# EasyEDA Pro project ProProject_Kame Quadrapot_2024-12-26.epro, schematic LU9685 + Buck + charging
Create Date: 2024-12-05; Page Name: LU9685 + Buck + charging; Project Name: Kame Quadrapot; Schematic Name: LU9685 + Buck + charging; Update Date: 2024-12-16; Company: EasyEDA.com; Drawn: EasyEDA; Page Size: A3; Part Number: JLCPCB-001; Reviewed: EasyEDA; Version: V0.1
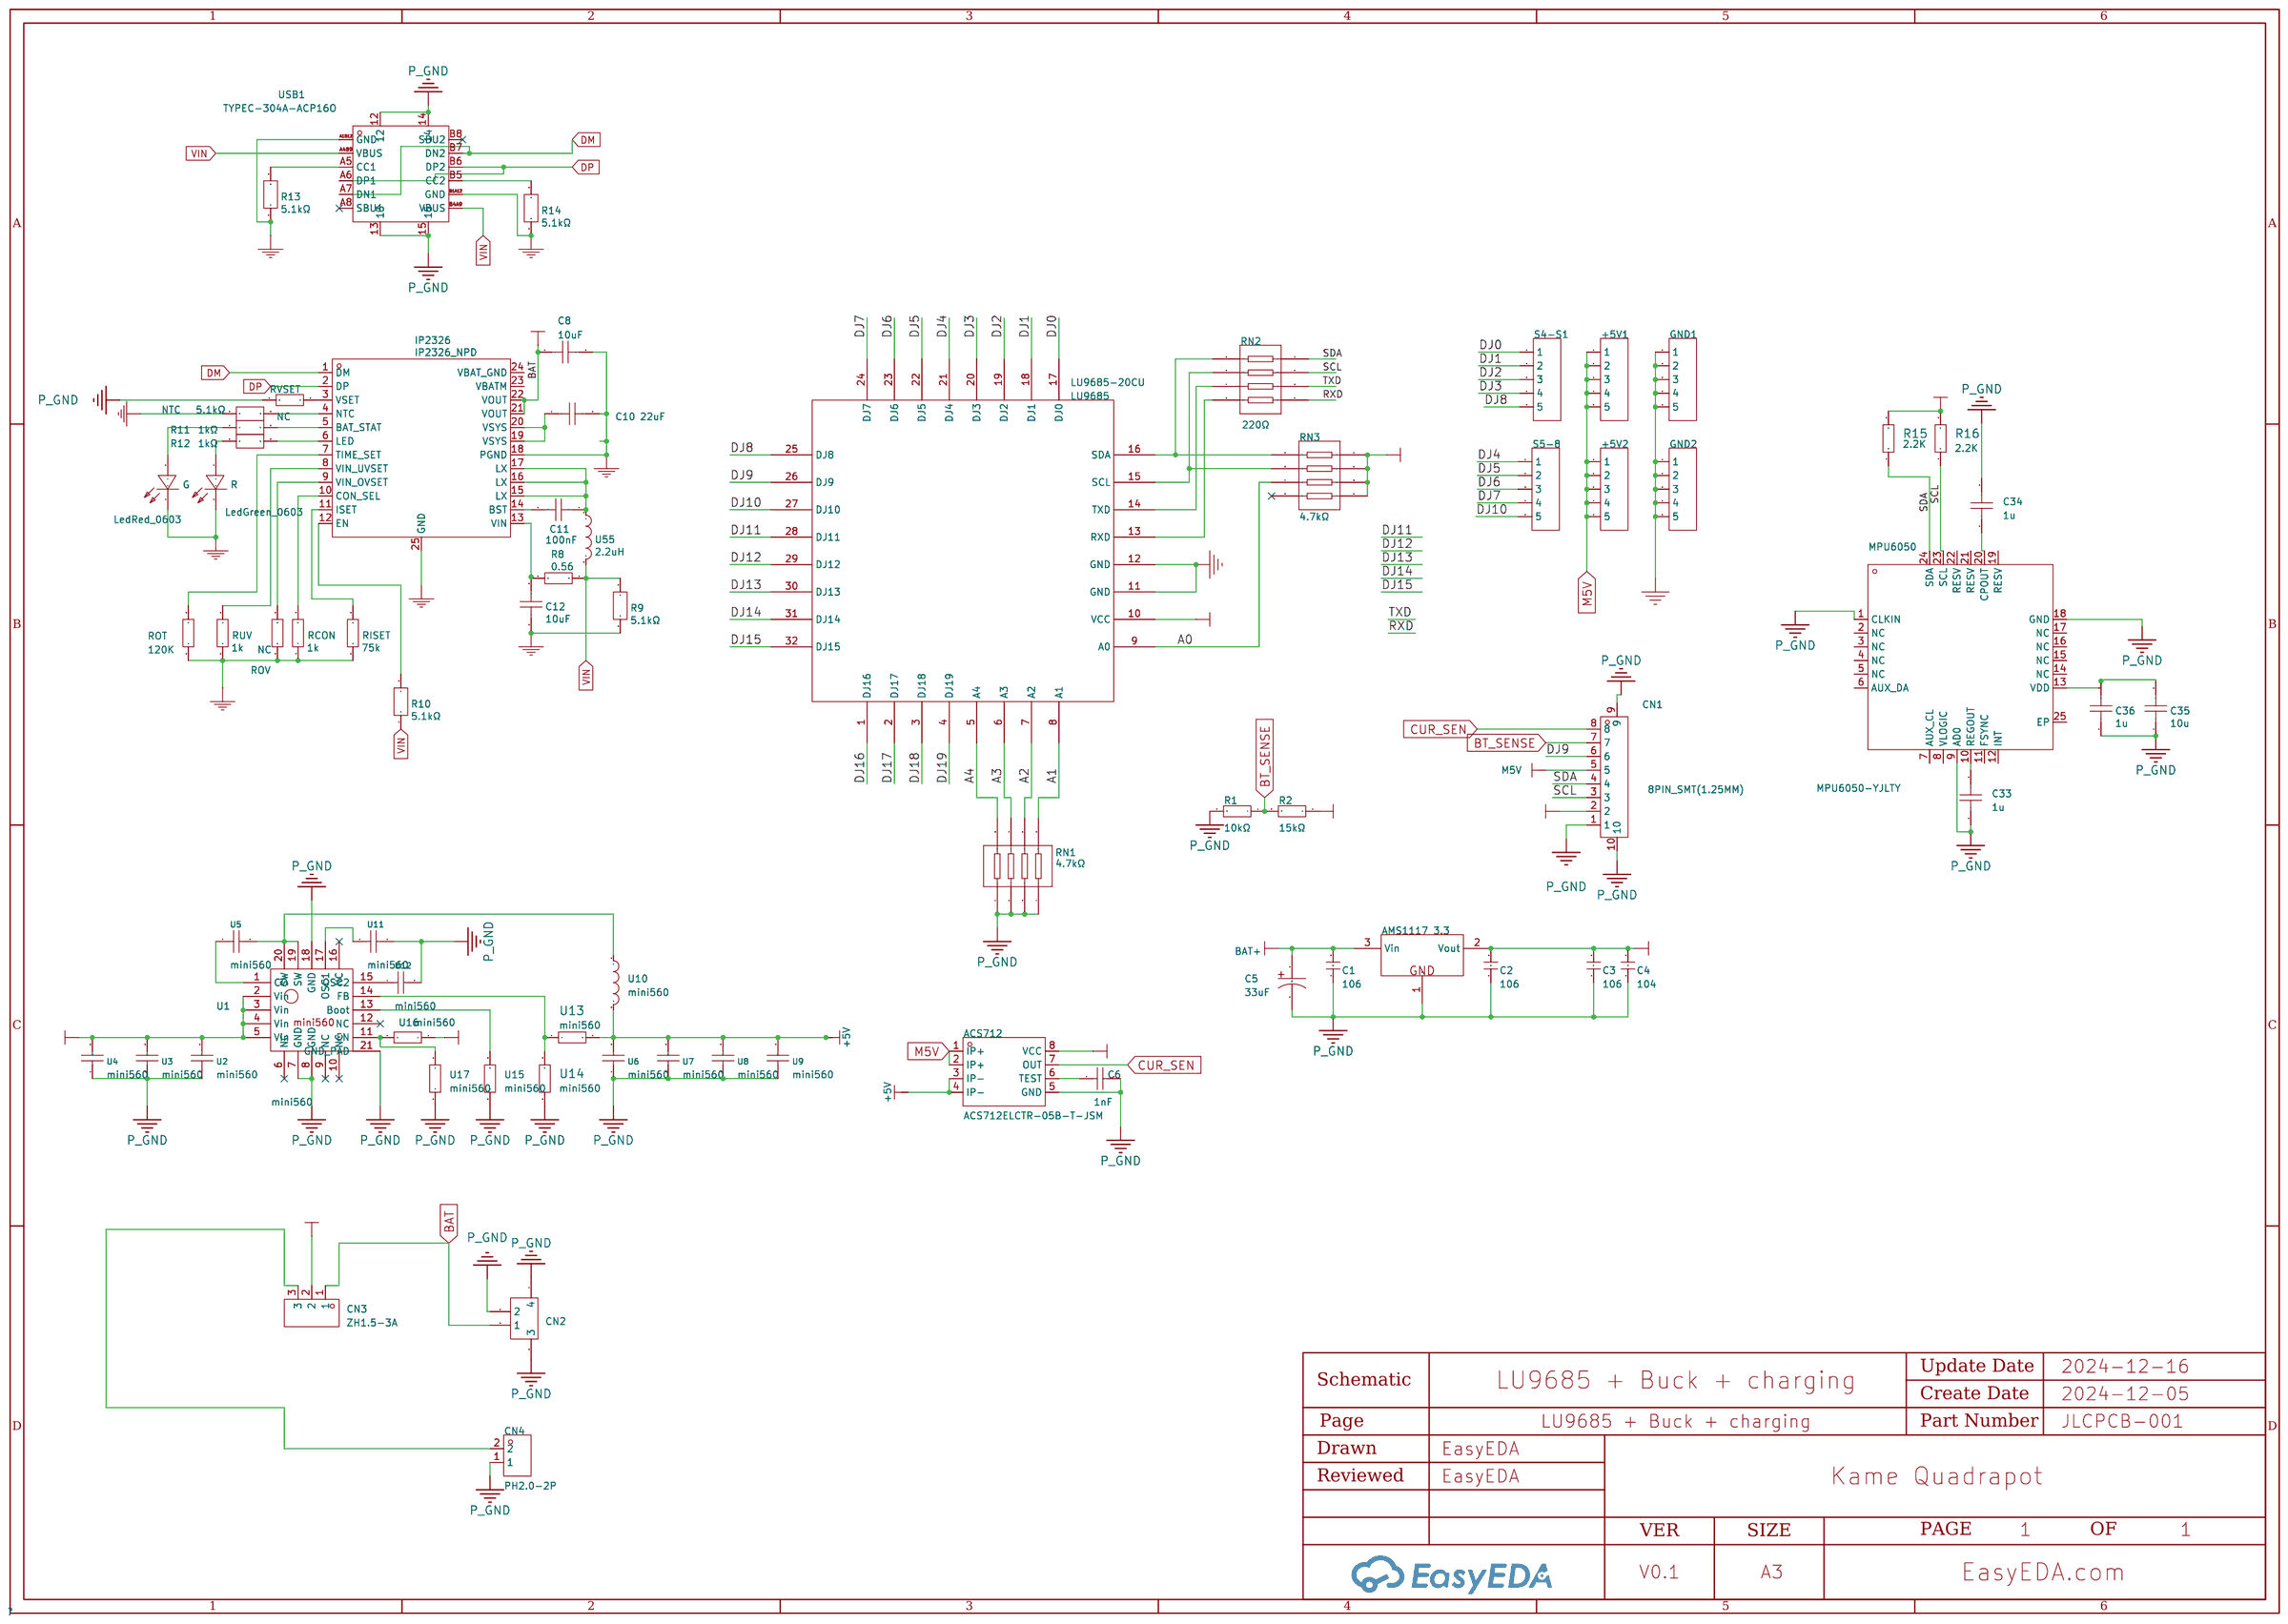
[diagram p2: schematic sheet]

## Parts
+5V1  2.54mm 1*5p Female header  [HDR-5X1/2.54]
+5V2  2.54mm 1*5p Female header  [HDR-5X1/2.54]
ACS712  ACS712ELCTR-05B-T-JSM  [SOP-8_L4.9-W3.9-P1.27-LS6.0-BL]
AMS1117 3.3  AMS1117-3.3  [TO-252-3_L6.6-W6.1-P4.58-LS10.1-BR]
C1  106  [C0805]
C2  106  [C0805]
C3  106  [C0805]
C4  104  [C0603]
C5  33uF  [CASE-D_7343]
C6  1nF  [C0805]
C8  10uF  [C0805]
C10  22uF  [C0805]
C11  100nF  [C0603]
C12  10uF  [C0805]
C33  1u  [C0603]
C34  1u  [C0603]
C35  10u  [C0603]
C36  1u  [C0603]
CN1  8PIN_SMT(1.25MM)  [CONN-SMD_8PIN_SMT-P1.25]
CN2  HDR-1X2  [CONN-SMD_PH2.0MM-2AWB]
CN3  ZH1.5-3A  [CONN-TH_ZH1.5-3A_C2829733]
CN4  PH2.0-2P  [2.54mm_1*2P_oval]
G  LedRed_0603  [LED0603-RD_RED]
GND1  2.54mm 1*5p Female header  [HDR-5X1/2.54]
GND2  2.54mm 1*5p Female header  [HDR-5X1/2.54]
IP2326  IP2326_NPD  [QFN-24_L4.0-W4.0-P0.50-BL-EP2.5]
LU9685  LU9685-20CU  [LQFP-32_L7.0-W7.0-P0.80-LS9.0-BL]
MPU6050  MPU6050-YJLTY  [QFN-24_L4.0-W4.0-P0.50-BL-EP2.7]
NTC  5.1kΩ  [R0603]
R  LedGreen_0603  [LED0603-RD_GREEN]
R1  10kΩ  [R0603]
R2  15kΩ  [R0603]
R8  0.56  [R0805]
R9  5.1kΩ  [R0603]
R10  5.1kΩ  [R0603]
R11  1kΩ  [R0603]
R12  1kΩ  [R0603]
R13  5.1kΩ  [R0603]
R14  5.1kΩ  [R0603]
R15  2.2K  [R0603]
R16  2.2K  [R0603]
RCON  1k  [R0603]
RISET  75k  [R0603]
RN1  4.7kΩ  [RES-ARRAY-SMD_0603-8P-L3.2-W1.6-BL]
RN2  220Ω  [RES-ARRAY-SMD_0603-8P-L3.2-W1.6-BL]
RN3  4.7kΩ  [RES-ARRAY-SMD_0603-8P-L3.2-W1.6-BL]
ROT  120K  [R0603]
ROV  NC  [R0603]
RUV  1k  [R0603]
RVSET  NC  [R0603]
S4-S1  2.54mm 1*5p Female header  [HDR-5X1/2.54]
S5-8  2.54mm 1*5p Female header  [HDR-5X1/2.54]
U1  mini560  [VQFN-20_L3.0-W3.0-P0.45-TL-EP]
U2  4.7uF  [C1206]
U3  4.7uF  [C1206]
U4  10nF  [C0603]
U5  1nF  [C0603]
U6  4.7uF  [C1206]
U7  4.7uF  [C1206]
U8  4.7uF  [C1206]
U9  4.7uF  [C1206]
U10  mini560  [IND-SMD_L11.6-W10.1]
U11  1nF  [C0603]
U12  1nF  [C0603]
U13  8.5kΩ  [R0603]
U14  8.1kΩ  [R0603]
U15  5.1kΩ  [R0603]
U16  5.1kΩ  [R0603]
U17  5.1kΩ  [R0603]
U55  2.2uH  [IND-SMD_L6.7-W6.5]
USB1  TYPEC-304A-ACP16O  [USB-SMD_TYPEC-304A-ACP16O]

## Library data of the parts
+5V1 +5V2 GND1 GND2 S4-S1 S5-8 = Header-Female-2.54_1x5: Supplier: LCSC; Manufacturer: BOOMELE; image: //image.lceda.cn/szlcsc/C50950.jpg; Supplier Part: C50950
ACS712 = ACS712ELCTR-05B-T-JSM: Current Range:5A Current Range:5A Supply Voltage:4.5V~5.5V Supply Voltage:4.5V~5.5V Sensitivity:185mV/A Operating Temperature:-40℃~+150℃ Operating Temperature:-40℃~+150℃; Supplier Part: C19673779; Manufacturer: JSMSEMI(杰盛微); Supplier Footprint: SOP-8; JLCPCB Part Class: Extended Part; Datasheet: https://atta.szlcsc.com/upload/public/pdf/source/20240223/96E2A298C26713E10FE0B9BE4088197B.pdf; Supplier: LCSC; Current Range: 5A; Supply Voltage: 4.5V~5.5V; Sensitivity: 185mV/A; Operating Temperature: -40℃~+150℃
AMS1117 3.3 = AMS1117-5.0: ------ѹоƬ; BOM____: --ѹоƬ; __Ȩ____: Դ----; ѧϰ__Դ: www.ooocke.com; Origin Footprint 2: SOT223_L; Origin Footprint 3: SOT223_M; Origin Footprint 4: SOT223_N; Origin Footprint 5: SOT89_N; Origin Footprint 6: SOT89_M; Origin Footprint 1: SOT89_L; Design Item ID: AMS1117; Library Name: 1.3   - --Դ--оƬ
C1-C3 = 106: -޼-----Ƭ----; BOM____: -޼-----Ƭ----; __Ȩ____: Դ----; ѧϰ__Դ: www.ooocke.com; Origin Footprint 2: C 0201_L; Origin Footprint 3: C 0402_L; Origin Footprint 4: C 0603_L; Origin Footprint 5: C 1206_L; Origin Footprint 6: C 1210_L; Origin Footprint 7: C 1808_L; Origin Footprint 8: C 1812_L; Origin Footprint 9: C 1825_L; Origin Footprint 10: C 2225_L; Origin Footprint 11: C 0201_M; Origin Footprint 12: C 0402_M; Origin Footprint 13: C 0603_M; Origin Footprint 14: C 0805_M; Origin Footprint 15: C 1206_M; Origin Footprint 16: C 1210_M; Origin Footprint 17: C 1808_M; Origin Footprint 18: C 1812_M; Origin Footprint 19: C 1825_M; Origin Footprint 20: C 2225_M; Origin Footprint 1: C 0805_L; Design Item ID: C; Library Name: 3.1   - -------------
C4 = 104: -޼-----Ƭ----; BOM____: -޼-----Ƭ----; __Ȩ____: Դ----; ѧϰ__Դ: www.ooocke.com; Origin Footprint 2: C 0201_L; Origin Footprint 3: C 0402_L; Origin Footprint 4: C 0805_L; Origin Footprint 5: C 1206_L; Origin Footprint 6: C 1210_L; Origin Footprint 7: C 1808_L; Origin Footprint 8: C 1812_L; Origin Footprint 9: C 1825_L; Origin Footprint 10: C 2225_L; Origin Footprint 11: C 0201_M; Origin Footprint 12: C 0402_M; Origin Footprint 13: C 0603_M; Origin Footprint 14: C 0805_M; Origin Footprint 15: C 1206_M; Origin Footprint 16: C 1210_M; Origin Footprint 17: C 1808_M; Origin Footprint 18: C 1812_M; Origin Footprint 19: C 1825_M; Origin Footprint 20: C 2225_M; Origin Footprint 1: C 0603_L; Design Item ID: C; Library Name: 3.1   - -------------
C5 = TPSC336M016R0300: Capacitance: Tolerance:±20% Tolerance:±20% Rated Voltage: Equivalent Series Resistance(ESR):300mΩ@100kHz; LCSC Part Name: 33uF ±20% 16V; Supplier Part: C3007651; Manufacturer: Kyocera AVX; Supplier Footprint: CASE-C-6032-28(mm); JLCPCB Part Class: Extended Part; Datasheet: https://atta.szlcsc.com/upload/public/pdf/source/20220428/F2E19F3316CC6C16CBBCC04F889AB5BE.pdf; Supplier: LCSC; Tolerance: ±20%; Equivalent Series Resistance(ESR): 300mΩ@100kHz
C6 = CL21B102KBCNNNC: Capacitance: Tolerance:±10% Tolerance:±10% Voltage Rated: Temperature Coefficient:; LCSC Part Name: 1nF ±10% 50V; Supplier Part: C46653; Manufacturer: SAMSUNG(三星); Supplier Footprint: 0805; JLCPCB Part Class: Basic Part; Datasheet: https://atta.szlcsc.com/upload/public/pdf/source/20160218/1457707763339.pdf; Supplier: LCSC; Tolerance: ±10%
C8 = 10uF: Supplier: LCSC; Manufacturer: TDK; Manufacturer Part: C2012X6S1C106M085AC; Supplier Part: C3865551; JLCPCB Part Class: Extend; JLCPCB SMD: Yes
C10 = 22uF: Supplier: LCSC; Supplier Part: C3908819; Manufacturer: TDK; Manufacturer Part: C2012X6S0J226M085AC
C11 = 100nF: Supplier: LCSC; Supplier Part: C138344; Manufacturer: null; Manufacturer Part: CT41-0603-2F4-50V-0.1uF-M(N); JLCPCB Part Class: Extended Part
C12 = 10uF: Supplier: LCSC; Supplier Part: C3894687; Manufacturer: TDK; Manufacturer Part: C2012X5R1V106M085AC
C33 C34 C36 = 1u: Manufacturer Part: ?
C35 = 10u: Manufacturer Part: ?
CN1 = 8PIN_SMT(1.25MM): Supplier Part: C9900003224; Supplier Footprint: CON-SMD-8PIN-P1.25mm; JLCPCB Part Class: Extended Part; Supplier: LCSC
CN2 = HDR-1X2: 2P-Ӳ--; BOM____: 2P-Ӳ--; __Ȩ____: Դ----; ѧϰ__Դ: www.ooocke.com; Design Item ID: Header 2; Library Name: 4.6   - -Ӳ----ž-3.5
CN3 = ZH1.5-3A: Pins Structure:1x3P Pitch:1.5mm Mounting Style:Direct Insert Reference Series:ZH Number of Pins:3P Number of Rows:1 Number of PINs Per Row:3 Current Rating (Max):1A Contact Material:Brass Contact Plating:Tin Operating Temperature Range:-25℃~+85℃ Operating; LCSC Part Name: 1x3P 间距:1.5mm 直插 系列:ZH; Supplier Part: C2829733; Manufacturer: FG(富港); Supplier Footprint: 插件,P=1.5mm; JLCPCB Part Class: Extended Part; Datasheet: https://atta.szlcsc.com/upload/public/pdf/source/20210425/C2829732_F26530E371F6662D5811C22FF273BDDC.pdf; Supplier: LCSC; Pins Structure: 1x3P; Pitch: 1.5mm; Mounting Style: Direct Insert; Reference Series: ZH; Number of Pins: 3P; Number of Rows: 1; Number of PINs Per Row: 3; Current Rating (Max): 1A; Contact Material: Brass; Contact Plating: Tin; Operating Temperature Range: -25℃~+85℃; Rated Voltage (Max): 100V
CN4 = PH2.0-2P: Supplier Part: C9900095162; Supplier Footprint: CONN-TH_2P-P2.00_BOSSIE_BX-PH2.0-2PZZ; JLCPCB Part Class: Extended Part; Supplier: LCSC
G = LedRed_0603: Supplier: Mouser
IP2326 = IP2326_NPD: Supplier: LCSC; Supplier Part: C5441281; Manufacturer: INJOINIC(英集芯); JLCPCB Part Class: Extended Part
LU9685 = LU9685-20CU: Design Item ID: STC8H1K16; Library Name: 15.1 - δ--------
MPU6050 = MPU6050-YJLTY: Supplier Part: C2912107; Supplier Footprint: QFN-24-EP(4x4); JLCPCB Part Class: Extended Part; Supplier: LCSC
NTC R9 R10 R13 R14 = 5.1kΩ: Supplier: LCSC; Supplier Part: C431786; Manufacturer: Walsin(华新科); Manufacturer Part: MR06X5101FTL; JLCPCB Part Class: Extended Part
R = LedGreen_0603: Supplier: Mouser
R1 R2 = 0603WAF1502T5E: Type:Thick Film Resistors Resistance:15kΩ Tolerance:±1% Tolerance:±1% Power(Watts): Overload Voltage (Max): Temperature Coefficient:±100ppm/℃ Temperature Coefficient:±100ppm/℃ Operating Temperature Range:-55℃~+155℃ Operating Temperature Range:-55℃~+155℃; LCSC Part Name: 15kΩ ±1% 100mW 厚膜电阻; Supplier Part: C22809; Manufacturer: UNI-ROYAL(厚声); Supplier Footprint: 0603; JLCPCB Part Class: Basic Part; Datasheet: https://atta.szlcsc.com/upload/public/pdf/source/20200306/C422600_1E6D84923E4A46A82E41ADD87F860B5C.pdf; Supplier: LCSC; Type: Thick Film Resistors; Tolerance: ±1%; Temperature Coefficient: ±100ppm/℃; Operating Temperature Range: -55℃~+155℃
R8 = 0.56: Supplier: LCSC; Manufacturer: RALEC; Manufacturer Part: RTT05R560FTP; Supplier Part: C104585; JLCPCB Part Class: Extended Part
R11 R12 = 1kΩ: Supplier: LCSC; Supplier Part: C2918515; Manufacturer: Walsin(华新科); Manufacturer Part: WR06X102JGL; JLCPCB Part Class: Extended Part
R15 R16 U13 U14 = 0603WAF8201T5E: Type:Thick Film Resistors Resistance:8.2kΩ Tolerance:±1% Tolerance:±1% Power(Watts): Overload Voltage (Max): Temperature Coefficient:±100ppm/℃ Temperature Coefficient:±100ppm/℃ Operating Temperature Range:-55℃~+155℃ Operating Temperature Range:-55℃~+155℃; LCSC Part Name: 8.2kΩ ±1% 100mW 厚膜电阻; Supplier Part: C25981; Manufacturer: UNI-ROYAL(厚声); Supplier Footprint: 0603; JLCPCB Part Class: Basic Part; Datasheet: https://atta.szlcsc.com/upload/public/pdf/source/20200306/C422600_1E6D84923E4A46A82E41ADD87F860B5C.pdf; Supplier: LCSC; Type: Thick Film Resistors; Tolerance: ±1%; Temperature Coefficient: ±100ppm/℃; Operating Temperature Range: -55℃~+155℃
RCON ROV RUV RVSET = 1k: Supplier: LCSC; Supplier Part: C9900013964; Manufacturer: null; Manufacturer Part: CN0603R103B3435FT; JLCPCB Part Class: Extended Part
RISET = 75k: Supplier: LCSC; Supplier Part: C9900013964; Manufacturer: null; Manufacturer Part: CN0603R103B3435FT; JLCPCB Part Class: Extended Part
RN1-RN3 = 4D03WGJ0472T5E: Number of Resistors: Resistance:4.7kΩ Tolerance:±5% Tolerance:±5% Power(Watts): Temperature Coefficient:±200ppm/℃ Temperature Coefficient:±200ppm/℃ Number of Pins:; LCSC Part Name: 4.7kΩ ±5%; Supplier Part: C1980; Manufacturer: UNI-ROYAL(厚声); Supplier Footprint: 0603x4; JLCPCB Part Class: Basic Part; Datasheet: https://atta.szlcsc.com/upload/public/pdf/source/20191224/C474318_2527498AE30E813171187CCD28401A71.pdf; Supplier: LCSC; Tolerance: ±5%; Temperature Coefficient: ±200ppm/℃
ROT = 120K: Supplier: LCSC; Supplier Part: C9900013964; Manufacturer: null; Manufacturer Part: CN0603R103B3435FT; JLCPCB Part Class: Extended Part
U1 = mini560: mini560 is an ic of a  buck 5V 4A DC buck converter. Actually I don`t know the ic name.
U2 U3 U6-U9 = 1206B475K500NT: Capacitance:4.7uF Tolerance:±10% Tolerance:±10% Voltage Rated: Temperature Coefficient:; LCSC Part Name: 4.7uF ±10% 50V; Supplier Part: C29823; Manufacturer: FH(风华); Supplier Footprint: 1206; JLCPCB Part Class: Basic Part; Datasheet: https://atta.szlcsc.com/upload/public/pdf/source/20200305/C486355_26A10D38EF8C2A5C37091D0039909270.pdf; Supplier: LCSC; Tolerance: ±10%
U4 U5 U11 U12 = 0603B103K500NT: Capacitance:10nF Tolerance:±10% Tolerance:±10% Voltage Rated: Temperature Coefficient:; LCSC Part Name: 10nF ±10% 50V; Supplier Part: C57112; Manufacturer: FH(风华); Supplier Footprint: 0603; JLCPCB Part Class: Basic Part; Datasheet: https://atta.szlcsc.com/upload/public/pdf/source/20200305/C486355_26A10D38EF8C2A5C37091D0039909270.pdf; Supplier: LCSC; Tolerance: ±10%
U10 = BCIHP1040SC-R15M: LCSC Part Name: 0.15UH ±20%; Supplier Part: C2921217; Manufacturer: BC(台湾诚阳); Supplier Footprint: 10x11.6x4; JLCPCB Part Class: Extended Part; Supplier: LCSC
U15-U17 = 0603WAF5101T5E: Type:Thick Film Resistors Resistance:5.1kΩ Tolerance:±1% Tolerance:±1% Power(Watts): Overload Voltage (Max): Temperature Coefficient:±100ppm/℃ Temperature Coefficient:±100ppm/℃ Operating Temperature Range:-55℃~+155℃ Operating Temperature Range:-55℃~+155℃; LCSC Part Name: 5.1kΩ ±1% 100mW 厚膜电阻; Supplier Part: C23186; Manufacturer: UNI-ROYAL(厚声); Supplier Footprint: 0603; JLCPCB Part Class: Basic Part; Datasheet: https://atta.szlcsc.com/upload/public/pdf/source/20200306/C422600_1E6D84923E4A46A82E41ADD87F860B5C.pdf; Supplier: LCSC; Type: Thick Film Resistors; Tolerance: ±1%; Temperature Coefficient: ±100ppm/℃; Operating Temperature Range: -55℃~+155℃
U55 = 2.2uH: Supplier: LCSC; Supplier Part: C3911671; Manufacturer: Coilcraft(线艺); Manufacturer Part: XGL6060-222MEC
USB1 = TYPEC-304A-ACP16O: Supplier: LCSC; Supplier Part: C2909610; Manufacturer: XUNPU(讯普); JLCPCB Part Class: Extended Part

## Nets
+5V: ACS712.3(IP-) ACS712.4(IP-) U6.2 U7.2 U8.2 U9.2 U10.2 U13.2
DVCC: ACS712.8(VCC) AMS1117 3.3.2(Vout) C2.2 C3.2 C4.2 CN1.2 LU9685.10(VCC) R15.2 R16.2 RN3.1 RN3.2 RN3.3 RN3.4
VIN: R8.2 R9.2 R10.1 U55.2 USB1.A4B9(VBUS) USB1.B4A9(VBUS)
A0: LU9685.9(A0) RN3.7
A1: LU9685.8(A1) RN1.5
A2: LU9685.7(A2) RN1.6
A3: LU9685.6(A3) RN1.7
A4: LU9685.5(A4) RN1.8
BAT: C8.1 CN2.2(1) CN3.1 IP2326.21(VOUT) IP2326.22(VOUT)
BAT+: AMS1117 3.3.3(Vin) C1.2 C5.1 CN3.2 R2.1 U1.2(Vin) U1.3(Vin) U1.4(Vin) U1.5(Vin) U2.2 U3.2 U4.2
BT_SENSE: CN1.7 R1.1 R2.2
CUR_SEN: ACS712.7(OUT) CN1.8
DJ0: LU9685.17(DJ0) S4-S1.1
DJ1: LU9685.18(DJ1) S4-S1.2
DJ2: LU9685.19(DJ2) S4-S1.3
DJ3: LU9685.20(DJ3) S4-S1.4
DJ4: LU9685.21(DJ4) S5-8.1
DJ5: LU9685.22(DJ5) S5-8.2
DJ6: LU9685.23(DJ6) S5-8.3
DJ7: LU9685.24(DJ7) S5-8.4
DJ8: LU9685.25(DJ8) S4-S1.5
DJ9: CN1.6 LU9685.26(DJ9)
DJ10: LU9685.27(DJ10) S5-8.5
DJ11: LU9685.28(DJ11)
DJ12: LU9685.29(DJ12)
DJ13: LU9685.30(DJ13)
DJ14: LU9685.31(DJ14)
DJ15: LU9685.32(DJ15)
DJ16: LU9685.1(DJ16)
DJ17: LU9685.2(DJ17)
DJ18: LU9685.3(DJ18)
DJ19: LU9685.4(DJ19)
DM: IP2326.1(DM) USB1.A7(DN1) USB1.B7(DN2)
DP: IP2326.2(DP) USB1.A6(DP1) USB1.B6(DP2)
M5V: +5V1.1 +5V1.2 +5V1.3 +5V1.4 +5V1.5 +5V2.1 +5V2.2 +5V2.3 +5V2.4 +5V2.5 ACS712.1(IP+) ACS712.2(IP+) CN1.5
P_GND: ACS712.5(GND) AMS1117 3.3.1(GND) C1.1 C2.1 C3.1 C4.1 C5.2 C6.2 C8.2 C10.2 C12.1 C33.2 C34.2 C35.1 C36.1 CN1.1 CN1.9 CN1.10 CN2.1(2) CN2.3 CN2.4 CN4.1 G.1(K) GND1.1 GND1.2 GND1.3 GND1.4 GND1.5 GND2.1 GND2.2 GND2.3 GND2.4 GND2.5 IP2326.18(PGND) IP2326.25(GND) LU9685.11(GND) LU9685.12(GND) MPU6050.1(CLKIN) MPU6050.9(AD0) MPU6050.18(GND) NTC.1 R.1(K) R1.2 R9.1 R13.1 R14.1 RCON.1 RISET.1 RN1.1 RN1.2 RN1.3 RN1.4 ROT.1 ROV.1 RUV.1 RVSET.2 U1.7(GND) U1.8(GND) U1.18(GND) U1.21(GND_PAD) U2.1 U3.1 U4.1 U6.1 U7.1 U8.1 U9.1 U11.2 U12.2 U14.1 U15.1 U17.1 USB1.12 USB1.13 USB1.14 USB1.15 USB1.A1B12(GND) USB1.B1A12(GND)
RXD: RN2.1
SCL: CN1.3 MPU6050.23(SCL) R16.1 RN2.3
SDA: CN1.4 MPU6050.24(SDA) R15.1 RN2.4
TXD: RN2.2
V+: U16.1
$1N2: LU9685.16(SDA) RN2.5 RN3.5
$1N6832: LU9685.14(TXD) RN2.7
$1N6846: LU9685.13(RXD) RN2.8
$1N6878: LU9685.15(SCL) RN2.6 RN3.6
$1N9487: C10.1 IP2326.19(VSYS) IP2326.20(VSYS)
$1N9489: C11.2 IP2326.14(BST)
$1N9490: C11.1 IP2326.15(LX) IP2326.16(LX) IP2326.17(LX) U55.1
$1N9492: C12.2 IP2326.13(VIN) R8.1
$1N9496: R14.2 USB1.B5(CC2)
$1N9497: R13.2 USB1.A5(CC1)
$1N9501: IP2326.4(NTC) NTC.2
$1N9502: IP2326.5(BAT_STAT) R11.2
$1N9503: IP2326.6(LED) R12.2
$1N9504: R.2(A) R12.1
$1N9505: G.2(A) R11.1
$1N9508: IP2326.10(CON_SEL) RCON.2
$1N9510: IP2326.8(VIN_UVSET) RUV.2
$1N9511: IP2326.7(TIME_SET) ROT.2
$1N9512: IP2326.11(ISET) RISET.2
$1N9513: IP2326.12(EN) R10.2
$1N13576: IP2326.9(VIN_OVSET) ROV.2
$1N15007: ACS712.6(TEST) C6.1
$1N16837: IP2326.3(VSET) RVSET.1
$1N21802: C33.1 MPU6050.10(REGOUT)
$1N21828: C34.1 MPU6050.20(CPOUT)
$1N21877: C35.2 C36.2 MPU6050.13(VDD)
Net-(CN3-3): CN3.3 CN4.2
Net-(U1-1): U1.1(CO) U5.1
Net-(U1-11): U1.11(EN) U16.2 U17.2
Net-(U1-13): U1.13(Boot) U15.2
Net-(U1-14): U1.14(FB) U13.1 U14.2
Net-(U1-15): U1.15(OSC2) U12.1
Net-(U1-17): U1.17(OSC1) U11.1
Net-(U1-19): U1.19(SW) U1.20(SW) U5.2 U10.1

Not connected (* = marked no-connect by the designer): IP2326 23(VBATM) 24(VBAT_GND); MPU6050 2(NC) 3(NC) 4(NC) 5(NC) 6(AUX_DA) 7(AUX_CL) 8(VLOGIC) 11(FSYNC) 12(INT) 14(NC) 15(NC) 16(NC) 17(NC) 19(RESV) 21(RESV) 22(RESV) 25(EP); RN3 8*; U1 6(NC)* 9(NC)* 10(NC)* 12(NC)* 16(NC)*; USB1 A8(SBU1)* B8(SBU2)*
